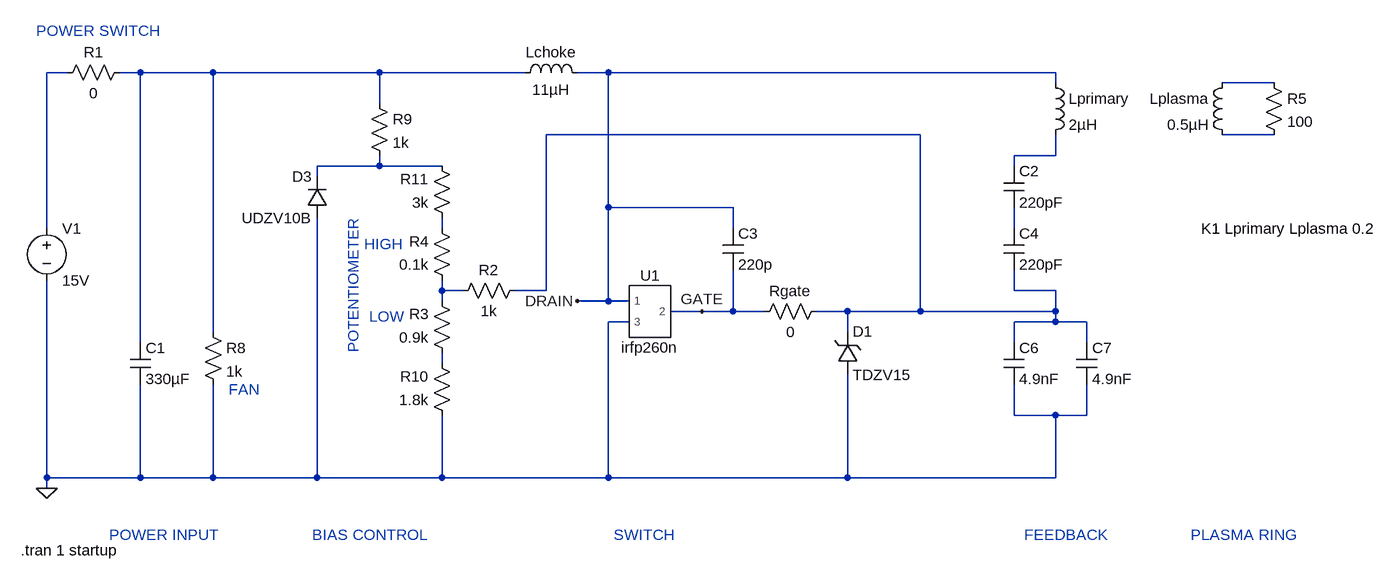
[diagram p0: schematic NikolaToy-PlasmaToroidDriver.asc]
NikolaToy-PlasmaToroidDriver.asc, the LTspice schematic file:
Version 4.1
SHEET 1 2388 680
WIRE 128 -432 96 -432
WIRE 240 -432 208 -432
WIRE 352 -432 240 -432
WIRE 608 -432 352 -432
WIRE 832 -432 608 -432
WIRE 960 -432 912 -432
WIRE 1648 -432 960 -432
WIRE 1648 -416 1648 -432
WIRE 1984 -416 1904 -416
WIRE 608 -384 608 -432
WIRE 1440 -336 864 -336
WIRE 1984 -336 1904 -336
WIRE 1648 -304 1648 -336
WIRE 1648 -304 1584 -304
WIRE 608 -288 608 -304
WIRE 608 -288 512 -288
WIRE 704 -288 608 -288
WIRE 1584 -288 1584 -304
WIRE 512 -272 512 -288
WIRE 960 -224 960 -432
WIRE 1152 -224 960 -224
WIRE 96 -192 96 -432
WIRE 704 -192 704 -208
WIRE 1152 -192 1152 -224
WIRE 1584 -192 1584 -224
WIRE 704 -96 704 -112
WIRE 736 -96 704 -96
WIRE 864 -96 864 -336
WIRE 864 -96 816 -96
WIRE 1584 -96 1584 -128
WIRE 1648 -96 1584 -96
WIRE 704 -80 704 -96
WIRE 960 -80 960 -224
WIRE 960 -80 912 -80
WIRE 992 -80 960 -80
WIRE 1104 -64 1056 -64
WIRE 1152 -64 1152 -128
WIRE 1152 -64 1104 -64
WIRE 1200 -64 1152 -64
WIRE 1328 -64 1280 -64
WIRE 1440 -64 1440 -336
WIRE 1440 -64 1328 -64
WIRE 1648 -64 1648 -96
WIRE 1648 -64 1440 -64
WIRE 992 -48 960 -48
WIRE 1648 -48 1648 -64
WIRE 1648 -48 1584 -48
WIRE 1696 -48 1648 -48
WIRE 352 -32 352 -432
WIRE 1328 -32 1328 -64
WIRE 240 -16 240 -432
WIRE 1584 -16 1584 -48
WIRE 1696 -16 1696 -48
WIRE 704 16 704 0
WIRE 1584 96 1584 48
WIRE 1648 96 1584 96
WIRE 1696 96 1696 48
WIRE 1696 96 1648 96
WIRE 96 192 96 -112
WIRE 240 192 240 48
WIRE 240 192 96 192
WIRE 352 192 352 48
WIRE 352 192 240 192
WIRE 512 192 512 -208
WIRE 512 192 352 192
WIRE 704 192 704 96
WIRE 704 192 512 192
WIRE 960 192 960 -48
WIRE 960 192 704 192
WIRE 1328 192 1328 32
WIRE 1328 192 960 192
WIRE 1648 192 1648 96
WIRE 1648 192 1328 192
WIRE 96 208 96 192
FLAG 96 208 0
FLAG 1104 -64 GATE
FLAG 912 -80 DRAIN
SYMBOL voltage 96 -208 R0
SYMATTR InstName V1
SYMATTR Value 15V
SYMBOL res 224 -448 R90
WINDOW 0 0 56 VBottom 2
WINDOW 3 32 56 VTop 2
SYMATTR InstName R1
SYMATTR Value 0
SYMBOL cap 224 -16 R0
SYMATTR InstName C1
SYMATTR Value 330µF
SYMBOL ind 816 -416 R270
WINDOW 0 32 56 VTop 2
WINDOW 3 5 56 VBottom 2
SYMATTR InstName Lchoke
SYMATTR Value 11µH
SYMATTR SpiceLine Rser=16m
SYMBOL ind 1632 -432 R0
SYMATTR InstName Lprimary
SYMATTR Value 2µH
SYMATTR Type ind
SYMATTR SpiceLine Rser=16m
SYMBOL ind 1920 -432 M0
SYMATTR InstName Lplasma
SYMATTR Value 0.5µH
SYMATTR Type ind
SYMBOL cap 1568 -288 R0
SYMATTR InstName C2
SYMATTR Value 220pF
SYMBOL cap 1568 -192 R0
SYMATTR InstName C4
SYMATTR Value 220pF
SYMBOL cap 1568 48 M180
WINDOW 0 24 56 Left 2
WINDOW 3 24 8 Left 2
SYMATTR InstName C6
SYMATTR Value 4.9nF
SYMBOL cap 1680 48 M180
WINDOW 0 24 56 Left 2
WINDOW 3 24 8 Left 2
SYMATTR InstName C7
SYMATTR Value 4.9nF
SYMBOL TVSdiode 1312 32 M180
WINDOW 0 24 65 Left 2
WINDOW 3 24 -2 Left 2
SYMATTR InstName D1
SYMATTR Value TDZV15
SYMBOL res 720 -80 R270
WINDOW 0 32 56 VTop 2
WINDOW 3 0 56 VBottom 2
SYMATTR InstName R2
SYMATTR Value 1k
SYMBOL res 720 16 R180
WINDOW 0 36 76 Left 2
WINDOW 3 36 40 Left 2
SYMATTR InstName R3
SYMATTR Value 0.9k
SYMBOL res 720 -96 R180
WINDOW 0 36 76 Left 2
WINDOW 3 36 40 Left 2
SYMATTR InstName R4
SYMATTR Value 0.1k
SYMBOL res 336 -48 R0
SYMATTR InstName R8
SYMATTR Value 1k
SYMBOL res 592 -400 R0
SYMATTR InstName R9
SYMATTR Value 1k
SYMBOL diode 528 -208 R180
WINDOW 0 24 64 Left 2
WINDOW 3 24 0 Left 2
SYMATTR InstName D3
SYMATTR Value UDZV10B
SYMATTR Description Diode
SYMATTR Type diode
SYMBOL res 720 112 R180
WINDOW 0 36 76 Left 2
WINDOW 3 36 40 Left 2
SYMATTR InstName R10
SYMATTR Value 1.8k
SYMBOL res 720 -192 R180
WINDOW 0 36 76 Left 2
WINDOW 3 36 40 Left 2
SYMATTR InstName R11
SYMATTR Value 3k
SYMBOL res 1968 -432 R0
SYMATTR InstName R5
SYMATTR Value 100
SYMBOL irfp260n 1024 -64 M0
SYMATTR InstName U1
SYMBOL res 1296 -80 R90
WINDOW 0 0 56 VBottom 2
WINDOW 3 32 56 VTop 2
SYMATTR InstName Rgate
SYMATTR Value 0
SYMBOL cap 1136 -192 R0
SYMATTR InstName C3
SYMATTR Value 220p
TEXT 80 -496 Left 2 ;POWER SWITCH
TEXT 568 -208 VRight 2 ;POTENTIOMETER
TEXT 592 -56 Left 2 ;LOW
TEXT 584 -168 Left 2 ;HIGH
TEXT 376 56 Left 2 ;FAN
TEXT 1872 -192 Left 2 !K1 Lprimary Lplasma 0.2
TEXT 1856 280 Left 2 ;PLASMA RING
TEXT 192 280 Left 2 ;POWER INPUT
TEXT 504 280 Left 2 ;BIAS CONTROL
TEXT 968 280 Left 2 ;SWITCH
TEXT 1600 280 Left 2 ;FEEDBACK
TEXT 56 304 Left 2 !.tran 1 startup

The netlist it stands for:
* NikolaToy-PlasmaToroidDriver.asc
V1 N001 0 15V
R1 N002 N001 0
C1 N002 0 330µF
Lchoke N002 DRAIN 11µH Rser=16m
Lprimary DRAIN N006 2µH Rser=16m
Lplasma N003 N005 0.5µH
C2 N006 N009 220pF
C4 N009 N004 220pF
C6 0 N004 4.9nF
C7 0 N004 4.9nF
D1 0 N004 TDZV15
R2 N010 N004 1k
R3 N011 N010 0.9k
R4 N010 N008 0.1k
R8 N002 0 1k
R9 N002 N007 1k
D3 0 N007 UDZV10B
R10 0 N011 1.8k
R11 N008 N007 3k
R5 N003 N005 100
X§U1 DRAIN GATE 0 irfp260n  ; pins 1 2 3
Rgate N004 GATE 0
C3 DRAIN GATE 220p
.model D D
.lib standard.dio
* POWER SWITCH
* POTENTIOMETER
* LOW
* HIGH
* FAN
K1 Lprimary Lplasma 0.2
* PLASMA RING
* POWER INPUT
* BIAS CONTROL
* SWITCH
* FEEDBACK
.tran 1 startup
.lib C:\Users\userl\Downloads\irfp260n.spi
.backanno
.end